# Altium project XOR.PrjPcb
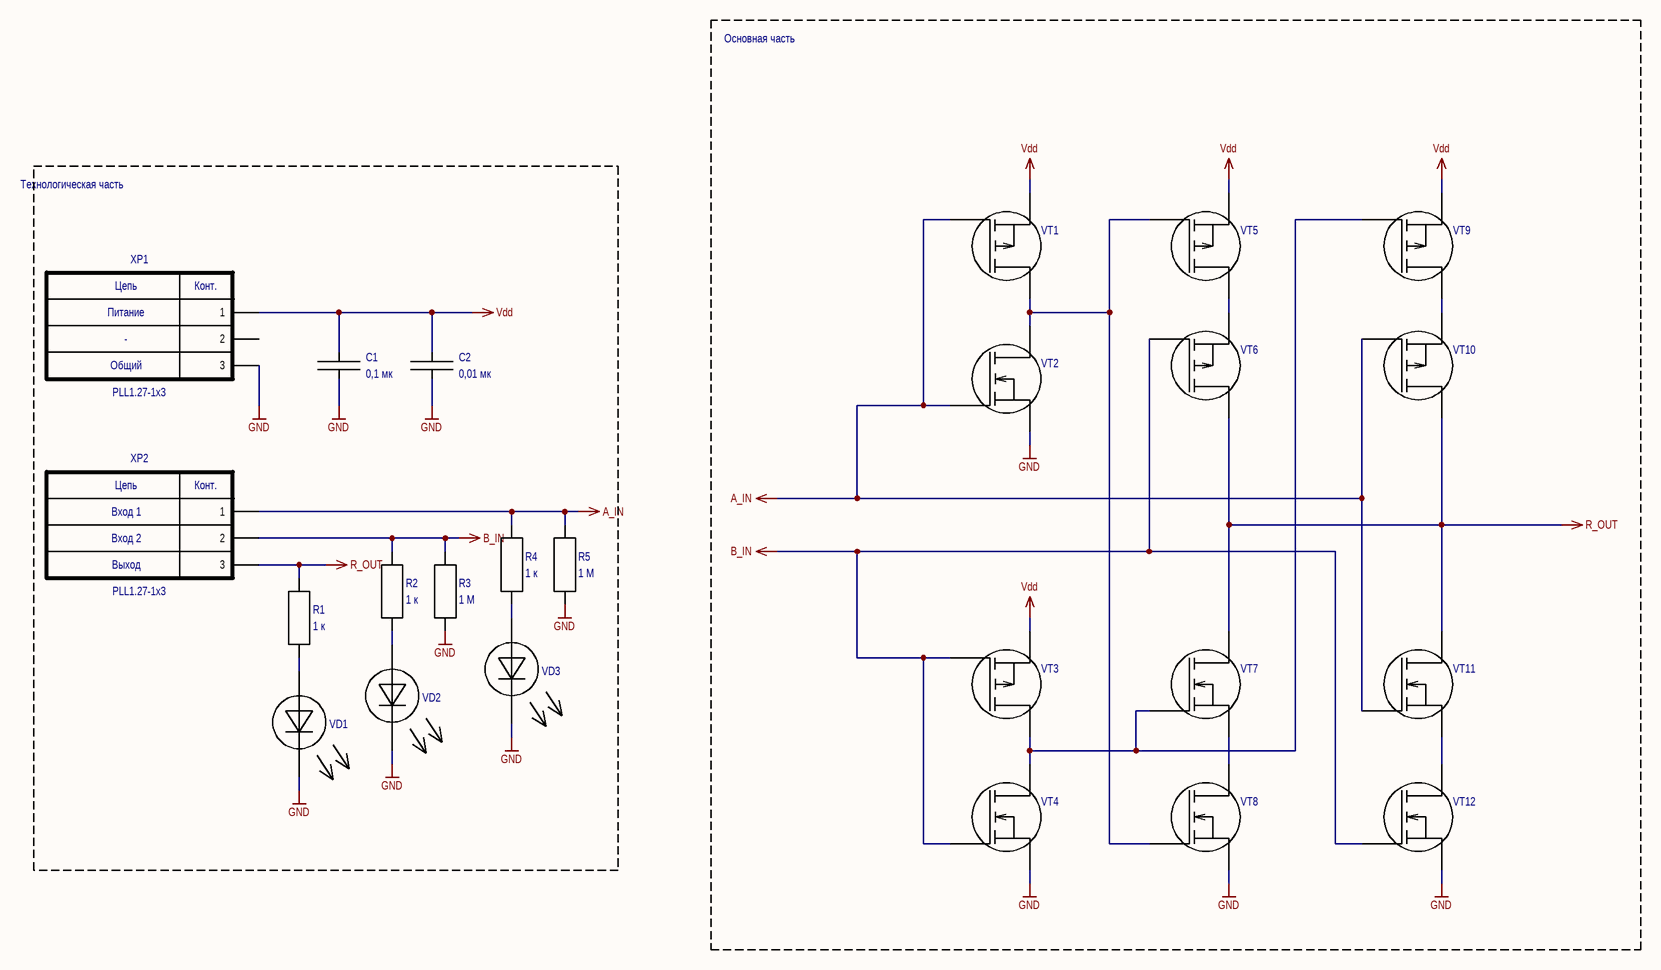
[diagram p0: Sheet6.SchDoc]
1 sheet, 24 parts. Net scope: global (net labels, ports and power ports of the same name join across sheets).
Board file: XOR1.PcbDoc

## Sheet Sheet6.SchDoc
size 420 x 297 mm; SheetNumber: 1; SheetTotal: 1

### Parts
C1  value 0,1 мк  [K10-79_1.6_0.8(0603)]  (hidden comment: 0,1 мкФ ±* * * *, *)
C2  value 0,01 мк  [K10-79_1.6_0.8(0603)]  (hidden comment: 0,01 мкФ ±* * * *, *)
R1  value 1 к  [P1-12-0.1(0603)]
R2  value 1 к  [P1-12-0.1(0603)]
R3  value 1 М  [P1-12-0.1(0603)]
R4  value 1 к  [P1-12-0.1(0603)]
R5  value 1 М  [P1-12-0.1(0603)]
VD1  VD - Светодиод  [LED 0603]  (value not drawn)
VD2  VD - Светодиод  [LED 0603]  (value not drawn)
VD3  VD - Светодиод  [LED 0603]  (value not drawn)
VT1  VT - Полевой транзистор P канал (MOSFET_P)  [SOT23(KT-46)]  (value not drawn)
VT2  VT - Полевой транзистор N канал (MOSFET_N)  [SOT23(KT-46)]  (value not drawn)
VT3  VT - Полевой транзистор P канал (MOSFET_P)  [SOT23(KT-46)]  (value not drawn)
VT4  VT - Полевой транзистор N канал (MOSFET_N)  [SOT23(KT-46)]  (value not drawn)
VT5  VT - Полевой транзистор P канал (MOSFET_P)  [SOT23(KT-46)]  (value not drawn)
VT6  VT - Полевой транзистор P канал (MOSFET_P)  [SOT23(KT-46)]  (value not drawn)
VT7  VT - Полевой транзистор N канал (MOSFET_N)  [SOT23(KT-46)]  (value not drawn)
VT8  VT - Полевой транзистор N канал (MOSFET_N)  [SOT23(KT-46)]  (value not drawn)
VT9  VT - Полевой транзистор P канал (MOSFET_P)  [SOT23(KT-46)]  (value not drawn)
VT10  VT - Полевой транзистор P канал (MOSFET_P)  [SOT23(KT-46)]  (value not drawn)
VT11  VT - Полевой транзистор N канал (MOSFET_N)  [SOT23(KT-46)]  (value not drawn)
VT12  VT - Полевой транзистор N канал (MOSFET_N)  [SOT23(KT-46)]  (value not drawn)
XP1  1: Питание  3: Общий  PartNumber: PLL1.27-1x3  [PCBComponent_1 - duplicate]  (hidden comment: Вилка PLL1.27-1x3 RUICHI)
XP2  1: Вход 1  2: Вход 2  3: Выход  PartNumber: PLL1.27-1x3  [PCBComponent_1 - duplicate]  (hidden comment: KONT_POLE_POWER)

### Blocks framed on the sheet
Основная часть: VT1-VT12

### Nets
A_IN: R4.1 R5.1 VT1.3 VT2.3 VT10.3 VT11.3 XP2.1
B_IN: R2.1 R3.1 VT3.3 VT4.3 VT6.3 VT12.3 XP2.2
GND: C1.1 C2.1 R3.2 R5.2 VD1.2(C) VD2.2(C) VD3.2(C) VT2.2 VT4.2 VT8.2 VT12.2 XP1.3
R_OUT: R1.1 VT6.2 VT7.1 VT10.2 VT11.1 XP2.3
Vdd: C1.2 C2.2 VT1.1 VT3.1 VT5.1 VT9.1 XP1.1
NetR1_2: R1.2 VD1.1(A)
NetR2_2: R2.2 VD2.1(A)
NetR4_2: R4.2 VD3.1(A)
NetVT1_2: VT1.2 VT2.1 VT5.3 VT8.3
NetVT3_2: VT3.2 VT4.1 VT7.3 VT9.3
NetVT5_2: VT5.2 VT6.1
NetVT7_2: VT7.2 VT8.1
NetVT9_2: VT9.2 VT10.1
NetVT11_2: VT11.2 VT12.1

Not connected (* = marked no-connect by the designer): XP1 2

### Notes on the sheet
- Технологическая часть
- Перв.примен.
- Справ. №
- Подп. и дата
- Инв.№ дубл.
- Взам. инв. №
- Изм.
- Лист
- № докум.
- Подп.
- Дата
- Лит.
- Масса
- Масштаб
- Пров.
- Т.контр
- Разраб.
- Схема электрическая принципиальная
- 1
- Листов
- Инв № подл.
- Н.контр.
- Утв.
- Копировал
- Формат А3
- (in symbol X - Контактное поле х3) Цепь; Конт.

### Library data of the parts
C1 C2 = C - Конденсатор: Company: *; PartNumber: *; Tolerance: *; Voltage: *; Type: *; Package: *
R1-R5 = R - Резистор: PartNumber: RC0603JR-071KL; Company: Yageo; Tolerance: 5 %; Package: 0603
VD1-VD3 = VD - Светодиод: PartNumber: GNL-0805UBC-TL; Company: G-nor; Value: GNL-0805UBC-TL; Package: 0603
VT1 VT3 VT5 VT6 VT9 VT10 = VT - Полевой транзистор P канал (MOSFET_P): VT; pin to pad: 1>2 2>3 3>1
VT2 VT4 VT7 VT8 VT11 VT12 = VT - Полевой транзистор N канал (MOSFET_N): VT; pin to pad: 1>3 3>1
XP1 = X - Контактное поле х3: 2: -; Company: RUICHI; Value: PLL1.27-1x3
XP2 = X - Контактное поле х3: Company: RUICHI; Value: PLL1.27-1x3